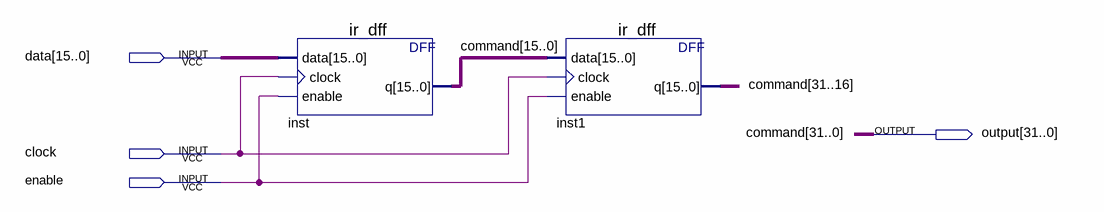
[diagram p0: schematic sheet]
// Quartus schematic IR.bdf as structural Verilog: 2 symbols, 4 pins
module IR (
  input  [15:0] data,
  input  clock,
  input  enable,
  output [31:0] \output 
);

  ir_dff inst (.data(data), .clock(clock), .enable(enable), .q(\output [15:0]));
  ir_dff inst1 (.data(\output [15:0]), .clock(clock), .enable(enable), .q(\output [31:16]));

  // Other names for the same wires on the sheet: command[31:0] = \output 
endmodule
